# Altium schematic sheet 5.1k ohm SCH.schdoc
size 127 x 99 mm
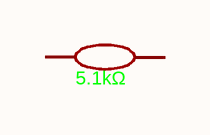
[diagram p0: 5.1k ohm SCH.schdoc]

## Parts
R?  5.1kΩ  [R0402]

## Nets

Not connected (* = marked no-connect by the designer): R? 1 2

## Library data of the parts
R? = AC0402FR-075K1L: RES SMD 5.1K OHM 1% 1/16W 0402; Manufacturer: YAGEO(国巨); Add into BOM: yes; Temperature Coefficient: ±100ppm/℃; Symbol: AC0402FR-075K1L; Device: AC0402FR-075K1L; LCSC Part Name: 厚膜电阻 5.1kΩ ±1% 62.5mW; Supplier Part: C144745; Manufacturer Part: AC0402FR-075K1L; Supplier Footprint: 0402; JLCPCB Part Class: Extended Part; Datasheet: https://atta.szlcsc.com/upload/public/pdf/source/20180927/C229861_4ABDC471507C1ED6AFB4BA66AFC8620A.pdf; Supplier: LCSC; Convert to PCB: yes; Type: Thick Film Resistors; Value: 5.1kΩ; Tolerance: ±1%; Operating Temperature Range: -55℃~+155℃; LCSC Part Number: C144745